# EAGLE design NanoRS485-MySens-v015 (EAGLE 7.6.0)
MAPLE-CUx Large Version
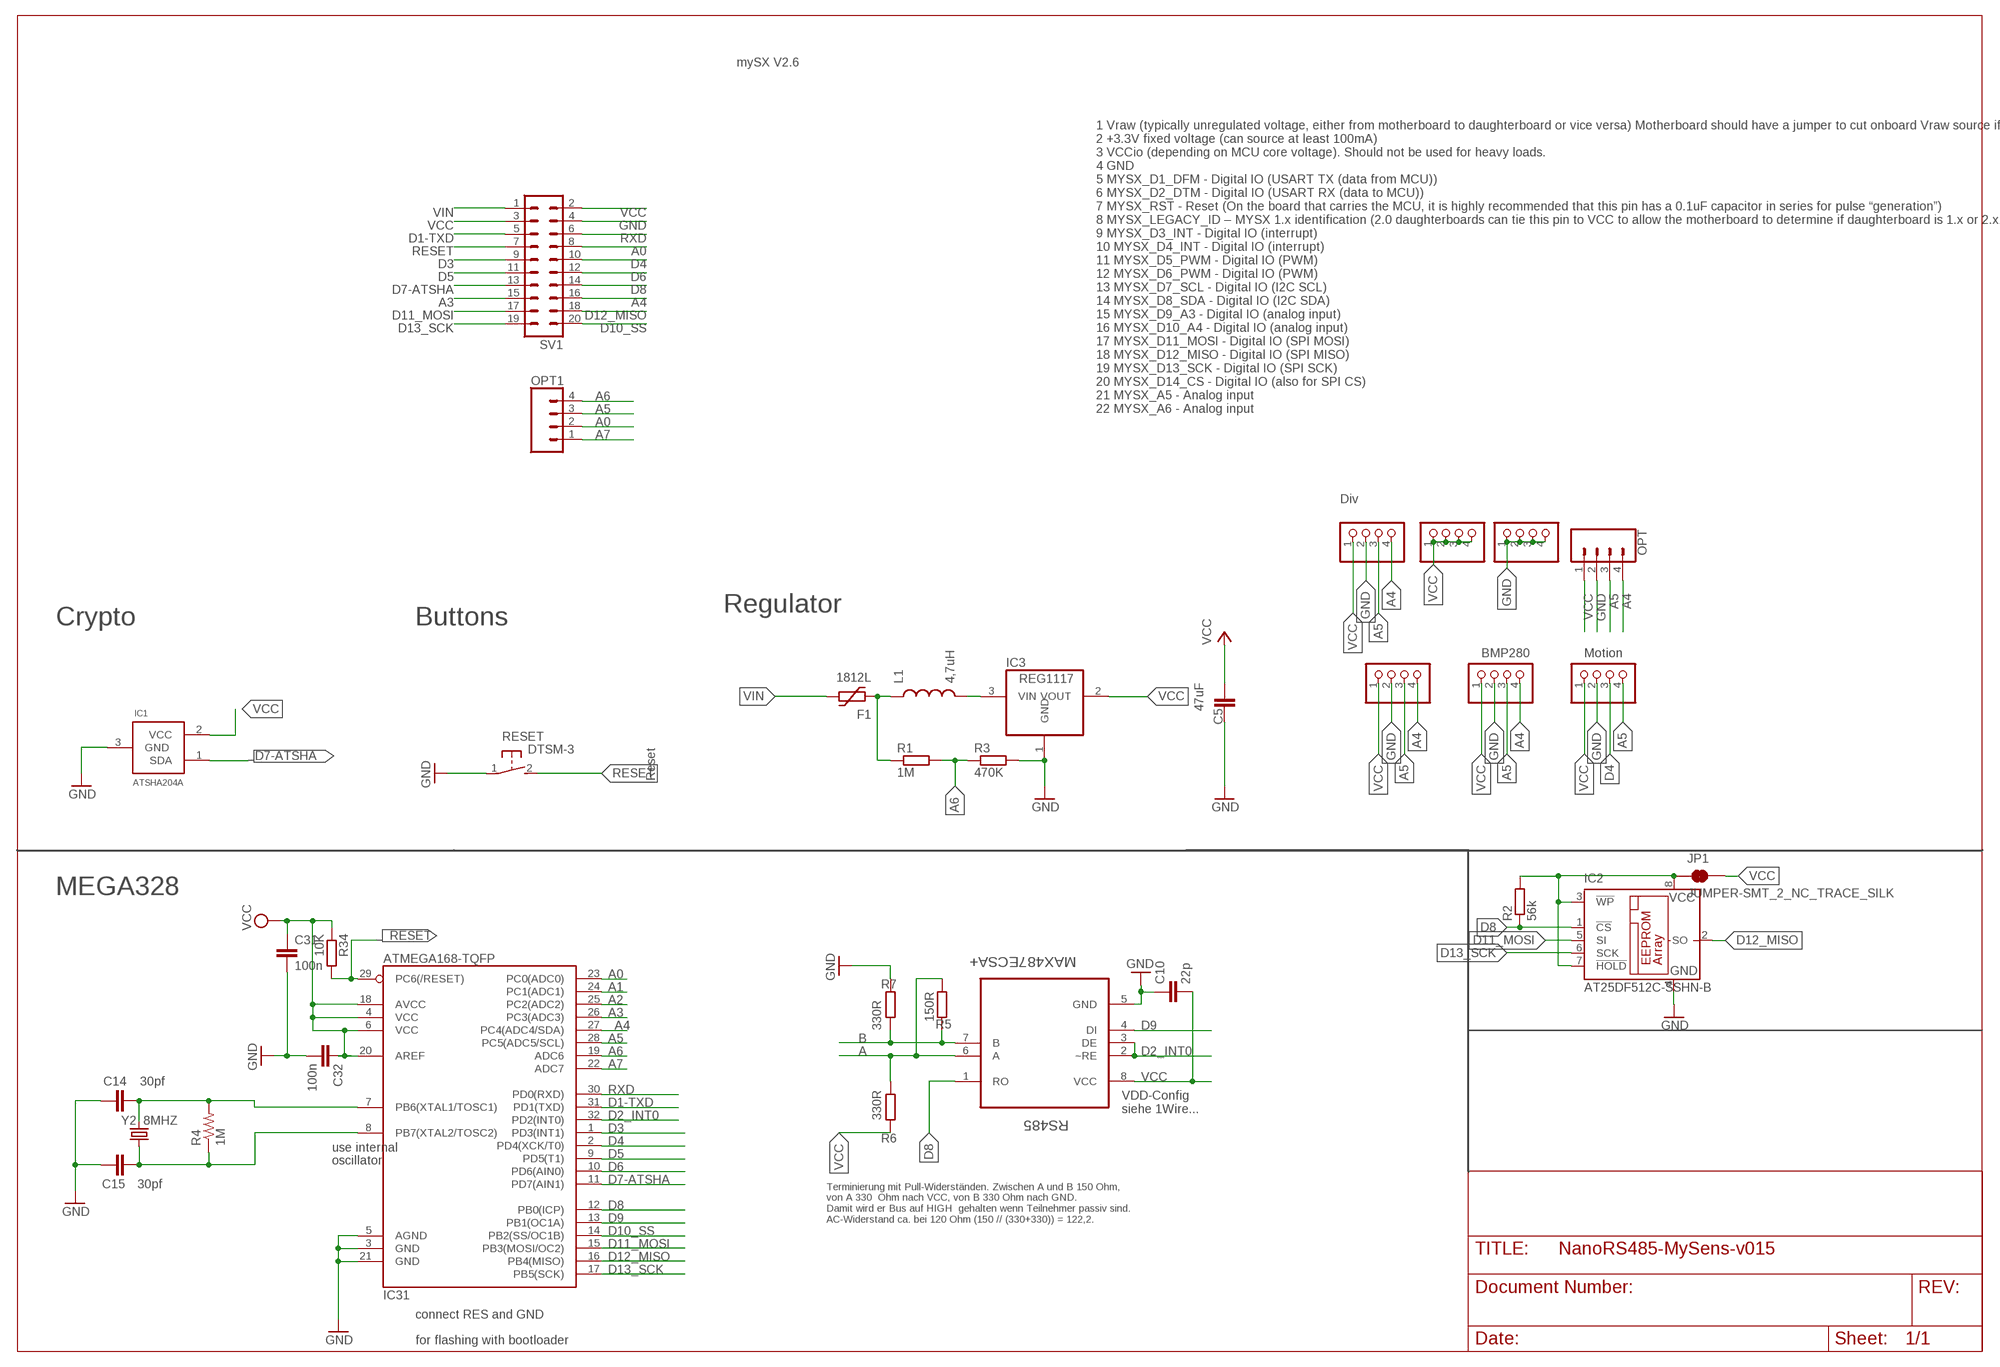
[diagram p0: schematic, sheet 1, part 1 of 2]
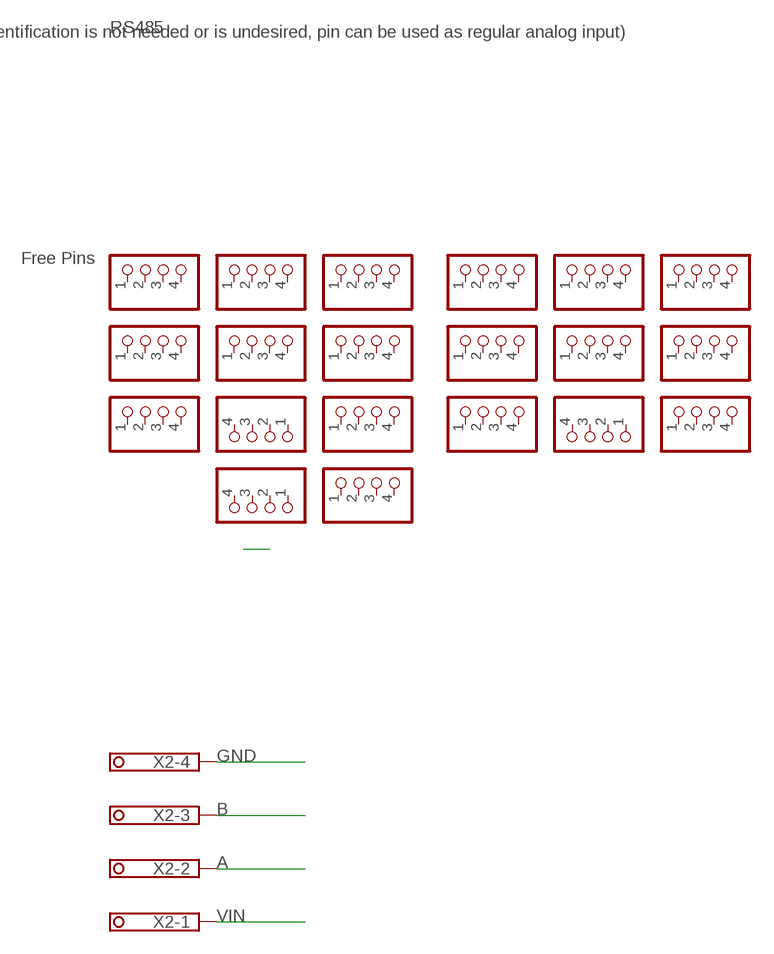
[diagram p1: schematic, sheet 1, part 2 of 2]

## Parts
BH1750  PINHD-1X04_2.54-S  [1X04-S]
C5  47uF  C-EUC1210  [C1210]
C10  22p  C-EUC0805  [C0805]
C14  30pf  CAP0805  [0805]
C15  30pf  CAP0805  [0805]
C31  100n  C-EUC0805  [C0805]
C32  100n  C-EUC0805  [C0805]
F1  1812L  [1812L]
I2C-1  PINHD-1X04_2.54-S  [1X04-S]
I2C-2  PINHD-1X04_2.54-S  [1X04-S]
IC1  ATSHA204A  [SOT23]
IC2  AT25DF512C-SSHN-B  25AA080SN  [SO-08]
IC3  REG1117  [SOT223]
IC31  ATMEGA168-TQFP  [TQFP32-08]
JP1  JUMPER-SMT_2_NC_TRACE_SILK  [SMT-JUMPER_2_NC_TRACE_SILK]
JP2  PINHD-1X04_2.54-S  [1X04-S]
JP3  PINHD-1X04_2.54-S  [1X04-S]
JP4  PINHD-1X04_2.54-S  [1X04-S]
JP5  PINHD-1X04_2.54-S  [1X04-S]
JP6  PINHD-1X04_2.54-S  [1X04-S]
JP7  PINHD-1X04_2.54-S  [1X04-S]
JP8  PINHD-1X04_2.54-S  [1X04-S]
JP9  PINHD-1X04_2.54-S  [1X04-S]
JP10  PINHD-1X04_2.54-S  [1X04-S]
JP11  PINHD-1X04_2.54-S  [1X04-S]
JP12  PINHD-1X04_2.54-S  [1X04-S]
JP13  PINHD-1X04_2.54-S  [1X04-S]
JP14  PINHD-1X04_2.54-S  [1X04-S]
JP15  PINHD-1X04_2.54-S  [1X04-S]
JP16  PINHD-1X04_2.54-S  [1X04-S]
JP17  PINHD-1X04_2.54-S  [1X04-S]
JP18  PINHD-1X04_2.54-S  [1X04-S]
JP19  PINHD-1X04_2.54-S  [1X04-S]
JP20  PINHD-1X04_2.54-S  [1X04-S]
JP21  PINHD-1X04_2.54-S  [1X04-S]
JP22  PINHD-1X04_2.54-S  [1X04-S]
JP23  PINHD-1X04_2.54-S  [1X04-S]
L1  4,7uH  INDUCTOR0805  [0805]
MOTION  PINHD-1X04_2.54-S  [1X04-S]
OPT  CONN_04  [1X04]
OPT1  CONN_04  [1X04]
R1  1M  R-EU_R0805  [R0805]
R2  56k  R-EU_M0805  [M0805]
R3  470K  R-EU_R0805  [R0805]
R4  1M  RESISTOR0805-RES  [0805]
R5  150R  R-EU_R0805  [R0805]
R6  330R  R-EU_R0805  [R0805]
R7  330R  R-EU_R0805  [R0805]
R34  10K  R-EU_R0805  [R0805]
RESET  DTSM-3  [DTSM-3]
RS485  MAX487ECSA+  [SOIC127P600X175-8N]
SV1  MA10-2  [MA10-2]
X2  1751264  [1751264]
Y2  8MHZ  CRYSTALTXC-7A  [CRYSTAL-TXC-7A]

## Nets
A: R5.1 R6.2 RS485.6(A) X2.2
A0: IC31.23(PC0(ADC0)) OPT1.2 SV1.8
A1: IC31.24(PC1(ADC1))
A2: IC31.25(PC2(ADC2))
A3: IC31.26(PC3(ADC3)) SV1.15
A4: BH1750.4 I2C-1.4 I2C-2.4 IC31.27(PC4(ADC4/SDA)) OPT.4 SV1.16
A5: BH1750.3 I2C-1.3 I2C-2.3 IC31.28(PC5(ADC5/SCL)) MOTION.4 OPT1.3 OPT.3
A6: IC31.19(ADC6) OPT1.4 R1.2 R3.1
A7: IC31.22(ADC7) OPT1.1
B: R5.2 R7.1 RS485.7(B) X2.3
D1-TXD: IC31.31(PD1(TXD)) SV1.5
D2_INT0: IC31.32(PD2(INT0)) RS485.2(~RE) RS485.3(DE)
D3: IC31.1(PD3(INT1)) SV1.9
D4: IC31.2(PD4(XCK/T0)) MOTION.3 SV1.10
D5: IC31.9(PD5(T1)) SV1.11
D6: IC31.10(PD6(AIN0)) SV1.12
D7-ATSHA: IC1.1(SDA) IC31.11(PD7(AIN1)) SV1.13
D8: IC2.1(!CS) IC31.12(PB0(ICP)) R2.1 RS485.1(RO) SV1.14
D9: IC31.13(PB1(OC1A)) RS485.4(DI)
D10_SS: IC31.14(PB2(SS/OC1B)) SV1.20
D11_MOSI: IC2.5(SI) IC31.15(PB3(MOSI/OC2)) SV1.17
D12_MISO: IC2.2(SO) IC31.16(PB4(MISO)) SV1.18
D13_SCK: IC2.6(SCK) IC31.17(PB5(SCK)) SV1.19
GND [PWR]: BH1750.2 C5.1 C10.1 C14.1 C15.1 C31.2 C32.2 I2C-1.2 I2C-2.2 IC1.3(GND) IC2.4(GND) IC3.1(GND) IC31.3(GND) IC31.5(AGND) IC31.21(GND) JP2.1 JP2.2 JP2.3 JP2.4 MOTION.2 OPT.2 R3.2 R7.2 RESET.1 RS485.5(GND) SV1.4 X2.4
N$3: C14.2 IC31.7(PB6(XTAL1/TOSC1)) R4.2 Y2.P$2
N$19: C15.2 IC31.8(PB7(XTAL2/TOSC2)) R4.1 Y2.P$1
RAW: IC3.3(VIN) L1.2
RESET: IC31.29(PC6(/RESET)) R34.2 RESET.2 SV1.7
RXD: IC31.30(PD0(RXD)) SV1.6
VCC [PWR]: BH1750.1 C5.2 C10.2 C31.1 C32.1 I2C-1.1 I2C-2.1 IC1.2(VCC) IC3.2(VOUT) IC31.4(VCC) IC31.6(VCC) IC31.18(AVCC) IC31.20(AREF) JP1.2 JP3.1 JP3.2 JP3.3 JP3.4 MOTION.1 OPT.1 R6.1 R34.1 RS485.8(VCC) SV1.2 SV1.3
VCC1 [PWR]: IC2.3(!WP) IC2.7(!HOLD) IC2.8(VCC) JP1.1 R2.2
VIN [PWR]: F1.P$2 SV1.1 X2.1
VIN-FUSED [PWR]: F1.P$1 L1.1 R1.1
Unconnected: JP4.1 JP4.2 JP4.3 JP4.4 JP5.1 JP5.2 JP5.3 JP5.4 JP6.1 JP6.2 JP6.3 JP6.4 JP7.1 JP7.2 JP7.3 JP7.4 JP8.1 JP8.2 JP8.3 JP8.4 JP9.1 JP9.2 JP9.3 JP9.4 JP10.1 JP10.2 JP10.3 JP10.4 JP11.1 JP11.2 JP11.3 JP11.4 JP12.1 JP12.2 JP12.3 JP12.4 JP13.1 JP13.2 JP13.3 JP13.4 JP14.1 JP14.2 JP14.3 JP14.4 JP15.1 JP15.2 JP15.3 JP15.4 JP16.1 JP16.2 JP16.3 JP16.4 JP17.1 JP17.2 JP17.3 JP17.4 JP18.1 JP18.2 JP18.3 JP18.4 JP19.1 JP19.2 JP19.3 JP19.4 JP20.1 JP20.2 JP20.3 JP20.4 JP21.1 JP21.2 JP21.3 JP21.4 JP22.1 JP22.2 JP22.3 JP22.4 JP23.1 JP23.2 JP23.3 JP23.4

## Notes on the sheet
- mySX V2.6
- RS485
- Free Pins
- 1 Vraw (typically unregulated voltage, either from motherboard to daughterboard or vice versa) Motherboard should have a jumper to cut onboard Vraw source if daughterboard provides Vraw. Be sure to check motherboard constraints on Vraw before connecting a daughterboard that provides Vraw (for over voltage protection). Should be able to source at least 100mA and all boards are recommended to support a voltage up to 24V on this pin.
  2 +3.3V fixed voltage (can source at least 100mA)
  3 VCCio (depending on MCU core voltage). Should not be used for heavy loads.
  4 GND
  5 MYSX_D1_DFM - Digital IO (USART TX (data from MCU))
  6 MYSX_D2_DTM - Digital IO (USART RX (data to MCU))
  7 MYSX_RST - Reset (On the board that carries the MCU, it is highly recommended that this pin has a 0.1uF capacitor in series for pulse “generation”)
  8 MYSX_LEGACY_ID – MYSX 1.x identification (2.0 daughterboards can tie this pin to VCC to allow the motherboard to determine if daughterboard is 1.x or 2.x. If identification is not needed or is undesired, pin can be used as regular analog input)
  9 MYSX_D3_INT - Digital IO (interrupt)
  10 MYSX_D4_INT - Digital IO (interrupt)
  11 MYSX_D5_PWM - Digital IO (PWM)
  12 MYSX_D6_PWM - Digital IO (PWM)
  13 MYSX_D7_SCL - Digital IO (I2C SCL)
  14 MYSX_D8_SDA - Digital IO (I2C SDA)
  15 MYSX_D9_A3 - Digital IO (analog input)
  16 MYSX_D10_A4 - Digital IO (analog input)
  17 MYSX_D11_MOSI - Digital IO (SPI MOSI)
  18 MYSX_D12_MISO - Digital IO (SPI MISO)
  19 MYSX_D13_SCK - Digital IO (SPI SCK)
  20 MYSX_D14_CS - Digital IO (also for SPI CS)
  21 MYSX_A5 - Analog input
  22 MYSX_A6 - Analog input
- Div
- Regulator
- Crypto | Buttons
- BMP280 | Motion
- Reset
- MEGA328
- VDD-Config
  siehe 1Wire...
- use internal
- oscillator
- Terminierung mit Pull-Widerständen. Zwischen A und B 150 Ohm,
  von A 330  Ohm nach VCC, von B 330 Ohm nach GND. 
  Damit wird er Bus auf HIGH  gehalten wenn Teilnehmer passiv sind.
  AC-Widerstand ca. bei 120 Ohm (150 // (330+330)) = 122,2.
- connect RES and GND
- for flashing with bootloader

## Library data of the parts
BH1750 I2C-1 I2C-2 JP2-JP23 MOTION = pinhead-2:PINHD-1X04: PIN HEADER
C5 C10 C31 C32 = rcl:C-EU: CAPACITOR, European symbol
C14 C15 = doug:CAP: Capacitor Standard 0603 ceramic capacitor, and 0.1" leaded capacitor.
F1 = ptc-littlefuse:1812L
IC1 = Sensor:ATSHA204A
IC2 = microchip:25*: Serial EEPROM 4K/ 8K , SPI bus; MF: MICROCHIP; MPN: 25AA080/SN; OC_FARNELL: 1816072; OC_NEWARK: 92C7351
IC3 = burr-brown:REG1117: 800mA and 1A Low Dropout (LDO) Positive Regulator 1.8V, 2.5V, 2.85V, 3.3V, 5V, and Adj; MPN: REG1117; OC_FARNELL: 1097566; OC_NEWARK: 14P6981
IC31 = atmel:ATMEGA168: Atmel Atmega 168/328/328P
JP1 = SparkFun-Jumpers:JUMPER-SMT_2_NC_TRACE: Normally closed trace jumper This jumper has a trace between two pads so it's normally closed (NC). Use a razor knife to open the connection. For best results follow the IPC guidelines for cutting traces: Cutout at least 0.063 mm (0.005 in). Remove all loose material to clean up the cut area. Seal the cut with an approved epoxy. Reapply solder to reclose the connection.
L1 = SparkFun-Passives:INDUCTOR: Inductors Basic Inductor/Choke - 0603 and 1206. Footprints are not proven and vary greatly between part numbers.
OPT OPT1 = SparkFun-Connectors:CONN_04: Multi connection point. Often used as Generic Header-pin footprint for 0.1 inch spaced/style header connections On any of the 0.1 inch spaced packages, you can populate with these: Break Away Headers - Straight <https://www.sparkfun.com/products/116> (PRT-00116) Break Away Male Headers - Right Angle <https://www.sparkfun.com/products/553> (PRT-00553) Female Headers <https://www.sparkfun.com/products/115> (PRT-00115) Break Away Headers - Machine Pin <https://www.sparkfun.com/products/117> (PRT-00117) Break Away Female Headers - Swiss Machine Pin <https://www.sparkfun.com/products/743> (PRT-00743) For SCREWTERMINALS and SPRING TERMINALS visit here: Screw Terimnals on SparkFun.com <https://www.sparkfun.com/search/results?term=Screw+Terminals> (5mm/3.5mm/2.54mm spacing) This device is also useful as a general connection point to wire up your design to another part of your project. Our various solder wires solder well into these plated through hole pads. Hook-Up Wire - Assortment (Stranded, 22 AWG) <https://www.sparkfun.com/products/11375> (PRT-11375) Hook-Up Wire - Assortment (Solid Core, 22 AWG) <https://www.sparkfun.com/products/11367> (PRT-11367) View the entire wire category on our website here <https://www.sparkfun.com/categories/141> Special notes: Molex polarized connector foot print use with SKU : PRT-08231 with associated crimp pins and housings. 1MM SMD Version SKU: PRT-10208; PROD_ID: CONN-09696
R1 R3 R5-R7 R34 = rcl:R-EU_: RESISTOR, European symbol
R2 = resistor:R-EU_: RESISTOR, European symbol
R4 = doug:RESISTOR: Resistor Basic schematic elements and footprints for 0603, 1206, and PTH resistors.
RESET = mechanics:DTSM-3: Diptronics SMD button 6x3.5 mm
RS485 = Maxim_By_element14_Batch_1:MAX487ECSA+: Low-Power, Slew-Rate-Limited RS-485/RS-422 Transceivers; MPN: MAX487ECSA+; OC_FARNELL: 9724532; OC_NEWARK: 68K4803; PACKAGE: SOIC-8; SUPPLIER: Maxim
SV1 = con-lstb:MA10-2: PIN HEADER; OC_FARNELL: unknown; OC_NEWARK: unknown
X2 = con-phoenix-350:1751264: MKDS 1/ 4-3,5 Printklemme Nennstrom: 10 A Bemessungsspannung: 160 V Raster: 3,5 mm Polzahl: 4 Montageart: Löten Anschlussart: Schraubanschluss Anschlussrichtung vom Leiter zur Platine: 0° Source: http://eshop.phoenixcontact.com .. 1751264.pdf; MPN: 1751264; OC_FARNELL: unknown; OC_NEWARK: 10R0934
Y2 = SparkFun-FreqCtrl:CRYSTAL: Various standard crystals. Proven footprints.

## Net classes
0 default: width 0.254 mm
1 PWR: width 0.406 mm

## Board
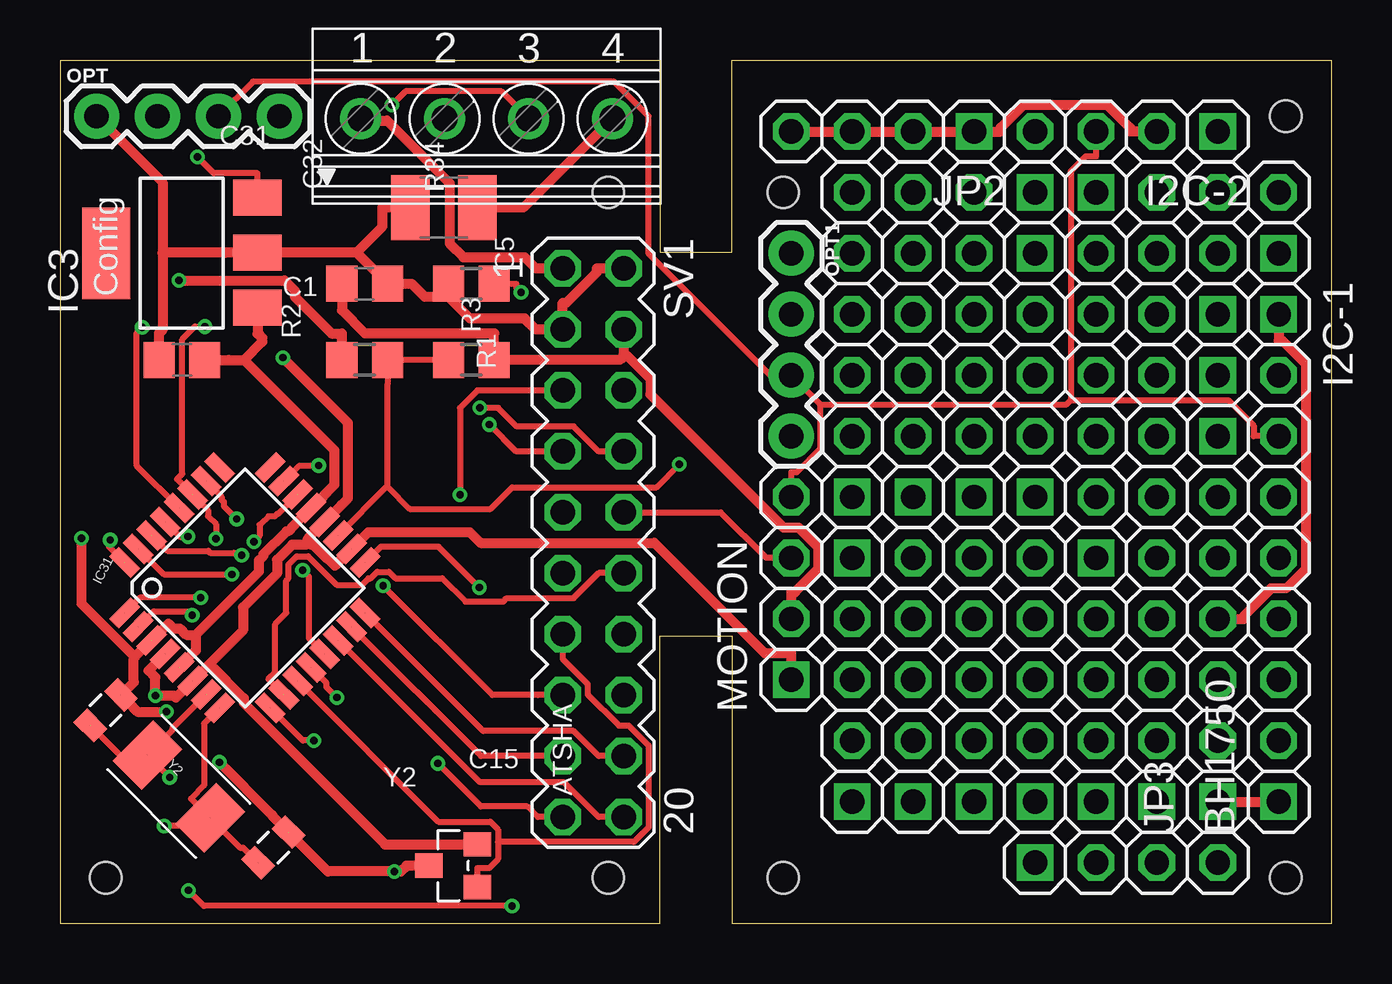
[diagram p2: board, top side]
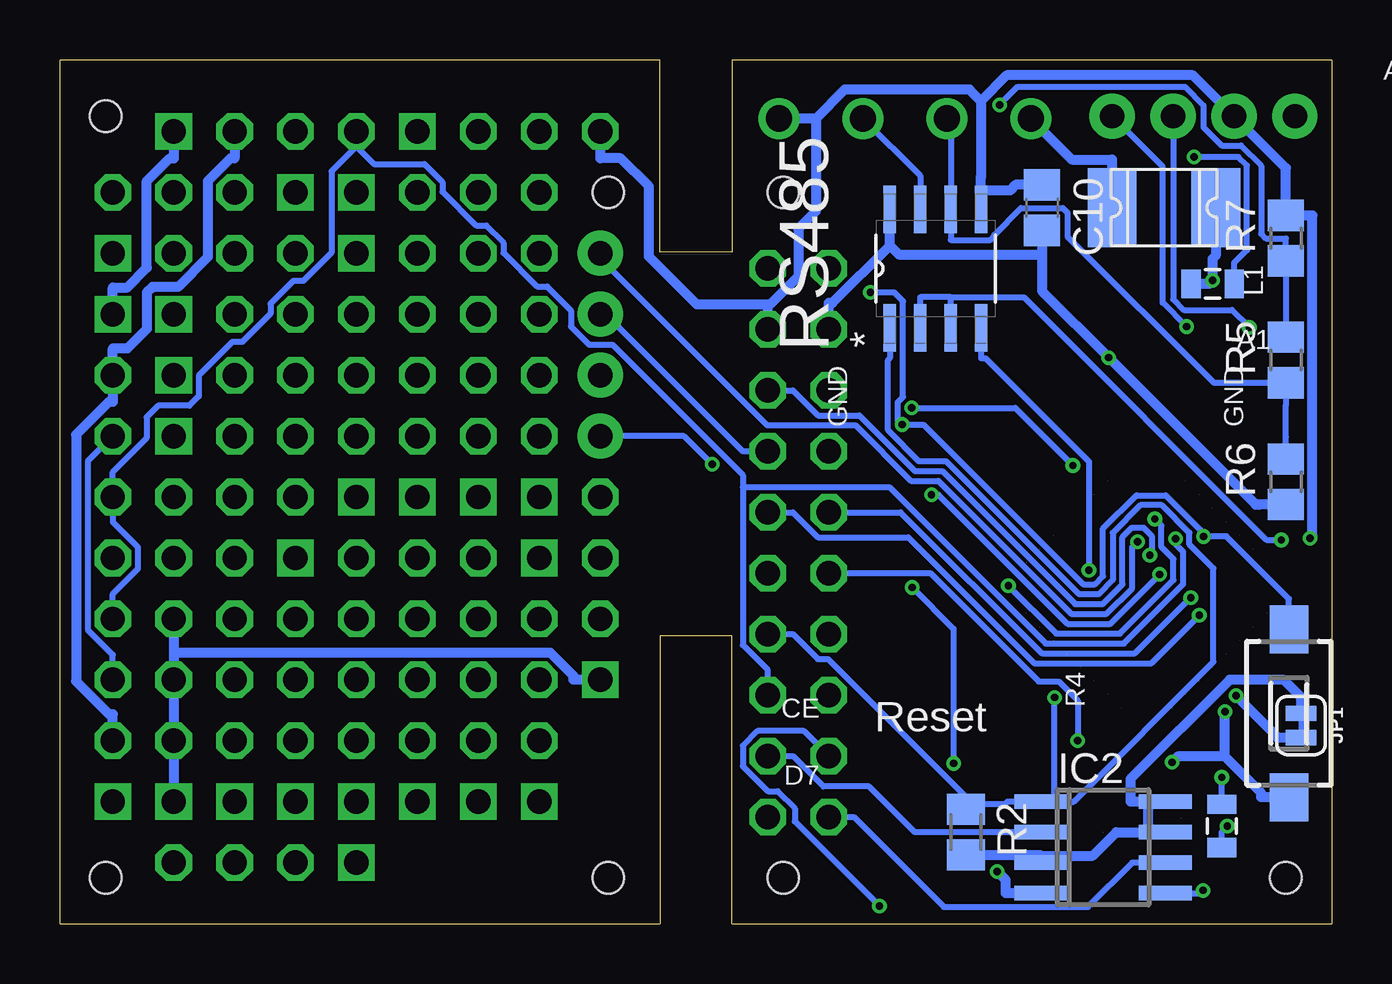
[diagram p3: board, bottom side, seen from below]

Size 53 x 36 mm. Coordinates in mm from the lower left corner, seen from the top.
Outline: 25,0 0,0 0,36 25,36 25,28 28,28 28,36 53,36 53,0 28,0 28,12 25,12 25,0
Copper layers (1*16): Top 0.035mm / dielectric 1.5mm / Bottom 0.035mm
Design rules "SeeedStudio_2layer_DRU_no_angle_20140221": minimum track width 6mil, minimum drill 12mil, track to track 6mil, track to pad 6mil, pad to pad 6mil, via to via 6mil, smd to smd 0mil, copper to edge 10mil, drill to drill 10mil, minimum pad ring 10mil, minimum via ring 6mil, stop-mask expansion 2mil, vias tented up to drill 100mil, thermal gap 10mil
Holes 1.3 mm at 22.86,30.48 22.86,1.91 1.91,1.91 30.14,30.48 51.09,1.91 30.14,1.91 51.09,33.66

### Footprints (pad centres in the part's own frame; a part is rotated, then mirrored left to right if it is on the bottom)
1X04-S = drill 1.016 square: 1 -3.81,0 | drill 1.016 octagon: 2 -1.27,0; 3 1.27,0; 4 3.81,0
C1210 = smd 1.6 x 2.7: 1 -1.4,0; 2 1.4,0
C0805 = smd 1.3 x 1.5: 1 -0.95,0; 2 0.95,0
0805 = smd 0.8 x 1.2: 1 -0.9,0; 2 0.9,0
1812L = smd 2.03 x 3.3: P$1 -2.16,0; P$2 2.16,0
SOT23 = smd 1.016 x 1.143: 1 -0.889,-1.016; 2 0.889,-1.016; 3 0,1.016
SO-08 = smd 0.6 x 2.2: 1 -1.905,-2.6; 2 -0.635,-2.6; 3 0.635,-2.6; 4 1.905,-2.6; 5 1.905,2.6; 6 0.635,2.6; 7 -0.635,2.6; 8 -1.905,2.6
SOT223 = smd 1.499 x 2.007: 1 -2.261,-3.15; 2 0.025,-3.15; 3 2.311,-3.15 | smd 3.81 x 2.007: 4 0,3.15
TQFP32-08 = smd 1.27 x 0.559: 1 -4.293,2.8; 2 -4.293,2; 3 -4.293,1.2; 4 -4.293,0.4; 5 -4.293,-0.4; 6 -4.293,-1.2; 7 -4.293,-2; 8 -4.293,-2.8; 17 4.293,-2.8; 18 4.293,-2; 19 4.293,-1.2; 20 4.293,-0.4; 21 4.293,0.4; 22 4.293,1.2; 23 4.293,2; 24 4.293,2.8 | smd 0.559 x 1.27: 9 -2.8,-4.293; 10 -2,-4.293; 11 -1.2,-4.293; 12 -0.4,-4.293; 13 0.4,-4.293; 14 1.2,-4.293; 15 2,-4.293; 16 2.8,-4.293; 25 2.8,4.293; 26 2,4.293; 27 1.2,4.293; 28 0.4,4.293; 29 -0.4,4.293; 30 -1.2,4.293; 31 -2,4.293; 32 -2.8,4.293
SMT-JUMPER_2_NC_TRACE_SILK = smd 0.635 x 1.27: 1 -0.508,0; 2 0.508,0
1X04 = drill 1.016 pad 1.88: 1 0,0; 2 2.54,0; 3 5.08,0; 4 7.62,0
R0805 = smd 1.3 x 1.5: 1 -0.95,0; 2 0.95,0
M0805 = smd 1.3 x 1.6: 1 -0.95,0; 2 0.95,0
DTSM-3 = smd 2 x 1.6: 1 -3.494,0; 2 3.494,0
SOIC127P600X175-8N = smd 1.981 x 0.533: 1 -2.464,1.905; 2 -2.464,0.635; 3 -2.464,-0.635; 4 -2.464,-1.905; 5 2.464,-1.905; 6 2.464,-0.635; 7 2.464,0.635; 8 2.464,1.905
MA10-2 = drill 1.016 octagon: 1 -11.43,-1.27; 2 -11.43,1.27; 3 -8.89,-1.27; 4 -8.89,1.27; 5 -6.35,-1.27; 6 -6.35,1.27; 7 -3.81,-1.27; 8 -3.81,1.27; 9 -1.27,-1.27; 10 -1.27,1.27; 11 1.27,-1.27; 12 1.27,1.27; 13 3.81,-1.27; 14 3.81,1.27; 15 6.35,-1.27; 16 6.35,1.27; 17 8.89,-1.27; 18 8.89,1.27; 19 11.43,-1.27; 20 11.43,1.27
1751264 = drill 1.1 pad 1.7: 1 -5.25,-0.1; 2 -1.75,-0.1; 3 1.75,-0.1; 4 5.25,-0.1
CRYSTAL-TXC-7A = smd 1.7 x 2.4: P$1 1.85,0; P$2 -1.85,0

### Placement (x,y rotation side)
BH1750  50.8,8.89 90 top
C5  16,29.84 180 top
C10  12.06,29.84 270 bottom
C14  1.91,8.89 225 top
C15  8.89,3.17 225 top
C31  12.7,26.67 180 top
C32  5.08,23.5 0 top
F1  6.99,29.84 180 bottom
I2C-1  50.8,21.59 270 top
I2C-2  44.45,33.02 180 top
IC1  16.38,2.41 90 top
IC2  9.53,3.17 270 bottom
IC3  5.08,27.94 90 top
IC31  7.71,14 45 top
JP1  1.27,8.26 270 bottom
JP2  34.29,33.02 180 top
JP3  48.26,8.89 90 top
JP4  33.02,21.59 90 top
JP5  46.99,30.48 0 top
JP6  35.56,21.59 90 top
JP7  44.45,2.54 0 top
JP8  38.1,21.59 90 top
JP9  36.83,27.94 180 top
JP10  36.83,15.24 0 top
JP11  44.45,22.86 180 top
JP12  36.83,30.48 180 top
JP13  44.45,17.78 0 top
JP14  44.45,20.32 180 top
JP15  44.45,25.4 180 top
JP16  46.99,27.94 180 top
JP17  45.72,8.89 90 top
JP18  46.99,15.24 0 top
JP19  40.64,8.89 90 top
JP20  43.18,8.89 90 top
JP21  35.56,8.89 90 top
JP22  38.1,8.89 90 top
JP23  33.02,8.89 90 top
L1  4.95,26.67 0 bottom
MOTION  30.48,13.97 90 top
OPT  1.52,33.66 0 top
OPT1  30.48,27.94 270 top
R1  12.7,23.5 0 top
R2  15.24,3.81 270 bottom
R3  17.14,23.5 0 top
R4  4.57,4.06 90 bottom
R5  1.91,23.5 90 bottom
R6  1.91,18.41 90 bottom
R7  1.91,28.57 90 bottom
R34  17.14,26.67 0 top
RESET  1.78,8.76 90 bottom
RS485  16.51,27.3 90 bottom
SV1  22.23,15.88 270 top
X2  17.78,33.66 0 top
Y2  4.95,5.71 315 top

### Tracks (layer width: path | path; a pad name or v marks a point on that pad's centre or on a via)
A
  Bottom 0.254: X2.2 15.88,33.4 RS485.6 15.88,28.5 14.22,28.5 14.06,28.66 14.06,28.7 12.94,29.82 11.2,29.82 11,29.63 11,28.64 4.91,22.55 R5.1 1.91,21.62 1.91,20.29 R6.2
A0  (via drill 0.3 pad 0.61)  (1 unrouted)
  Top 0.254: v17.5,21.5 18.27,21.5 19.04,20.73 21.41,20.73 22.45,19.68 SV1.8 | v10.78,19.09 9.98,19.09 IC31.23
  Bottom 0.254: v17.5,21.5 13.19,21.5 v10.78,19.09 | SV1.8 24.54,19.68 30.25,25.4 OPT1.2
A3  (via drill 0.3 pad 0.61)  (1 unrouted)
  Top 0.254: 6.74,17.8 | 6.74,17.8 6.74,17.67 6.83,17.58 6.83,17.4 v7.37,16.86 | v13.47,14.08 18.02,9.53 19.91,9.53 SV1.15 | IC31.26 6.74,17.8
  Bottom 0.254: v13.47,14.08 11.47,12.09 8.81,12.09 6.59,14.31 6.59,15.19 7.09,15.69 7.09,16.58 v7.37,16.86
A4  (via drill 0.3 pad 0.61)  (1 unrouted)
  Top 0.254: 6.17,17.23 | 6.17,17.23 6.17,16.98 6.5,16.65 v6.5,16.04 | v6.04,24.89 5.62,24.89 5.1,24.36 5.1,18.75 4.88,18.53 IC31.27 5.85,17.56 6.17,17.23
  Bottom 0.254: 24.54,18.19 18.43,18.19 11.91,11.67 8.65,11.67 6.18,14.15 6.18,15.49 6.5,15.81 v6.5,16.04 | v6.04,24.89 7.04,25.88 7.04,31.55 OPT.4 | BH1750.4 50.8,13.74 49.76,14.78 49.76,15.7 50.8,16.74 I2C-1.4 50.8,18.3 50.8,18.82 49.39,20.23 49.39,21.11 48.91,21.59 47.61,21.59 47.22,21.98 47.22,22.84 45.82,24.25 45.4,24.25 44.22,25.43 44.22,25.84 43.28,26.79 42.86,26.79 41.68,27.97 41.68,31.36 40.65,32.4 40.64,32.4 | 40.64,32.4 39.91,31.66 37.81,31.66 37.06,30.91 37.06,30.5 35.65,29.1 35.24,29.1 34.52,28.38 34.52,27.96 33.11,26.55 32.7,26.55 31.7,25.56 31.7,24.89 30.94,24.13 29.97,24.13 24.54,18.7 24.54,18.19 | 40.64,32.4 40.64,32.5 I2C-2.4 | 24.54,18.19 24.54,11.61 23.5,10.57 SV1.16
A5  (via drill 0.3 pad 0.61)  (1 unrouted)
  Top 0.254: 31.7,21.64 OPT1.3 29.6,22.86 24.53,27.92 24.53,33.65 23.09,35.09 8.04,35.09 OPT.3 | 31.7,21.64 31.7,19.82 30.71,18.82 30.48,18.82 MOTION.4 | 31.7,21.64 41.95,21.64 42.13,21.82 | 42.13,21.82 48.69,21.82 49.76,20.75 49.76,20.32 I2C-1.3 | 42.13,21.82 42.13,31.36 42.75,31.98 43.18,31.98 I2C-2.3 | IC31.28 3.2,19.07 3.2,24.63 v3.43,24.86
  Bottom 0.254: BH1750.3 50.8,11.2 51.84,12.24 51.84,19.28 I2C-1.3 | OPT.3 6.6,26.02 6.16,25.58 4.15,25.58 v3.43,24.86
A6  (via drill 0.3 pad 0.61)  (1 unrouted)
  Top 0.254: 13.65,18.21 14.57,17.29 17.95,17.29 18.85,18.19 24.86,18.19 v25.81,19.14 | 13.65,18.21 13.65,22.47 R1.2 R3.1 | IC31.19 13.62,18.21 13.65,18.21
  Bottom 0.254: v25.81,19.14 26.99,20.32 OPT1.4
A7  (via drill 0.3 pad 0.61)  (1 unrouted)
  Top 0.254: v8.08,15.92 8.32,16.16 8.32,16.62 8.35,16.65 8.37,16.65 8.7,16.97 8.96,16.97 9.07,17.09 9.11,17.09 9.25,17.23 IC31.22
  Bottom 0.254: OPT1.1 30.48,27.73 23.52,20.78 19.85,20.78 17.53,18.46 16.39,18.46 10.85,12.91 9.38,12.91 8.31,13.98 8.31,15.69 v8.08,15.92
B  (via drill 0.3 pad 0.61)
  Top 0.254: X2.3 18.4,34.69 14.4,34.69 v13.84,34.13
  Bottom 0.254: v13.84,34.13 13.09,34.88 6.1,34.88 5.33,34.11 5.33,33.2 4.57,32.44 3.78,32.44 2.93,31.59 2.93,28.76 2.73,28.55 1.91,28.55 R7.1 R5.2 | X2.3 17.14,31.17 RS485.7
D1-TXD  (via drill 0.3 pad 0.61)  (1 unrouted)
  Top 0.254: SV1.5 17.4,22.23 16.67,21.5 v16.67,17.87 | IC31.31 4.33,14.55 v7.17,14.55
  Bottom 0.254: v16.67,17.87 16.39,17.87 11.01,12.5 9.21,12.5 7.17,14.54 v7.17,14.55
D2_INT0  (via drill 0.3 pad 0.61)  (1 unrouted)
  Top 0.254: v2.09,15.99 2.05,15.95 2.05,15.7 IC31.32
  Bottom 0.254: 15.88,26.11 12.83,26.11 2.71,15.99 v2.09,15.99 | 15.88,26.11 17.14,26.11 RS485.2 | RS485.3 15.88,26.11
D3  (via drill 0.3 pad 0.61)  (1 unrouted)
  Top 0.254: v5.86,13.59 3.34,13.59 IC31.1
  Bottom 0.254: SV1.9 17.97,17.14 12.08,11.26 8.19,11.26 v5.86,13.59
D4  (via drill 0.3 pad 0.61)  (1 unrouted)
  Top 0.254: IC31.2 3.91,13.02 3.94,12.99 5.36,12.99 v5.51,12.85 | MOTION.3 29.44,15.24 27.53,17.14 SV1.10
  Bottom 0.254: v5.51,12.85 7.51,10.85 12.39,10.85 17.64,16.1 21.41,16.1 22.45,17.14 SV1.10
D5  (via drill 0.3 pad 0.61)  (1 unrouted)
  Top 0.254: v10.58,7.62 10.12,7.62 IC31.9
  Bottom 0.254: v10.58,7.62 10.58,9.3 11.37,10.08 12.2,10.08 16.72,14.61 19.91,14.61 SV1.11
D6  (1 unrouted)
  Top 0.254: 12.99,14.43 12.95,14.39 12.86,14.39 12.59,14.12 11.54,14.12 10.35,15.31 9.87,15.31 9.53,14.97 9.53,14.39 9.44,14.3 9.44,12.95 8.97,12.49 8.97,10.48 8.69,10.19 IC31.10 | 12.99,14.43 | 12.99,14.43 13.23,14.67 13.71,14.67 13.98,14.39 15.93,14.39 16.9,13.42 18.48,13.42 18.62,13.56 21.41,13.56 22.45,14.61 SV1.12
D7-ATSHA  (1 unrouted)
  Top 0.254: 18.26,3.4 18.26,2.68 17.89,2.31 17.4,2.31 IC1.1 | IC31.11 15.77,4.24 17.94,4.24 18.26,3.92 18.26,3.4 | 18.26,3.4 23.93,3.4 24.54,4.01 24.54,7.42 23.7,8.26 23.29,8.26 22,9.55 22,9.98 20.95,11.02 SV1.13
D8  (via drill 0.3 pad 0.61)  (1 unrouted)
  Top 0.254: IC31.12 11.11,10.03 11.11,9.85 v11.54,9.42
  Bottom 0.254: 11.54,5.08 v11.54,9.42 | 11.54,5.08 10.75,5.08 4.92,10.91 4.92,14.81 5.92,15.81 5.92,16.28 7.08,17.45 7.96,17.45 9.12,16.29 9.12,14.31 9.71,13.73 10.52,13.73 16.06,19.27 17.19,19.27 18.49,20.56 18.49,23.5 18.41,23.57 RS485.1 | 11.54,5.08 IC2.1 13.5,5.08 13.59,4.99 15.24,4.99 | 15.24,4.99 15.24,5.22 15.24,5.28 20.98,11.02 21.41,11.02 22.45,12.06 SV1.14 | R2.1 15.24,4.99
D9  (via drill 0.3 pad 0.61)  (1 unrouted)
  Top 0.254: v10.11,14.72 10.38,14.45 10.38,11.89 IC31.13
  Bottom 0.254: v10.11,14.72 10.11,19.25 14.43,23.57 14.61,23.57 RS485.4
D10_SS  (1 unrouted)
  Top 0.254: IC31.14 17.51,5.89 21.01,5.89 22.45,4.45 SV1.20
D11_MOSI  (via drill 0.3 pad 0.61)  (1 unrouted)
  Top 0.254: v18.85,0.73 6,0.73 v5.35,1.38 | SV1.17 17.55,6.99 IC31.15
  Bottom 0.254: SV1.17 22,8.03 23.93,8.03 24.54,7.41 24.54,6.56 23.5,5.51 23.09,5.51 22.37,4.79 22.37,4.26 v18.85,0.73 | IC2.5 5.55,1.27 5.43,1.38 v5.35,1.38
D12_MISO  (1 unrouted)
  Top 0.254: SV1.18 22.45,6.99 21.41,8.03 17.64,8.03 IC31.16
  Bottom 0.254: SV1.18 22.45,6.99 21.18,5.71 19.27,5.71 17.37,3.81 IC2.2
D13_SCK  (via drill 0.3 pad 0.61)  (1 unrouted)
  Top 0.254: v15.75,6.67 17.55,4.88 19.48,4.88 19.91,4.45 SV1.19 | IC31.17 13.37,15.7 15.78,15.7 v17.47,14.01
  Bottom 0.254: v17.47,14.01 15.75,12.29 v15.75,6.67 | IC2.6 8.3,2.54 10.15,0.69 16.16,0.69 19.91,4.45 SV1.19
GND  (via drill 0.3 pad 0.61)  (4 unrouted)
  Top 0.406: IC31.5 5.66,11.38 | 3.12,11.11 IC31.3 4.53,12.51 4.74,12.3 5,12.3 5.26,12.04 5.66,12.04 | 3.12,11.11 3.08,11.06 3.08,10.06 C14.1 2.88,9.19 3.22,8.85 3.23,8.83 v4.44,8.83 | v0.89,16.06 0.89,13.34 3.12,11.11 | 23.5,23.65 23.34,23.5 R3.2 18.09,24.6 12.71,24.6 11.75,25.56 C31.2 | 7.67,23.5 8.44,24.25 8.44,24.41 8.28,24.57 8.23,24.57 IC3.1 | 7.67,23.5 7.04,23.5 C32.2 | 7.67,23.5 11.44,19.73 11.44,18.29 11.16,18.02 10.81,17.66 IC31.21 9.76,16.61 9.5,16.35 9.44,16.35 8.49,15.4 8.49,15.33 8.3,15.14 8.3,14.67 5.66,12.04 | v6.65,6.72 8.85,4.52 8.85,4.49 C15.1 11.16,2.17 v13.94,2.17 14.2,2.17 14.44,2.41 IC1.3 | 5.66,12.04 5.66,11.38 | 5.66,11.38 | X2.4 19.32,29.84 C5.1 | 23.5,23.65 23.5,23.79 SV1.4 | MOTION.2 30.48,13.82 30.64,13.82 31.6,14.78 31.6,15.7 30.79,16.51 30.16,16.51 24.61,22.06 24.61,22.7 23.66,23.65 23.5,23.65 | I2C-2.2 44.6,33.02 44.6,33.18 43.64,34.14 40.17,34.14 39.22,33.19 39.22,33.02 JP2.1 JP2.2 JP2.3 JP2.4
  Bottom 0.406: v0.89,16.06 0.8,16.15 0.8,29.52 R7.2 1.91,31.5 OPT.2 5.77,35.36 13.55,35.36 14.62,34.29 | C10.1 13.17,30.8 13.39,30.57 14.61,30.57 | 14.61,30.57 14.61,31.11 14.62,31.13 14.62,34.29 | RS485.5 14.61,30.57 | 14.62,34.29 15.09,34.76 20.29,34.76 21.5,33.55 | 4.45,6.96 v4.45,8.83 v4.44,8.83 | 4.45,6.96 6.41,6.96 v6.65,6.72 | 4.45,6.96 2.93,5.45 2.93,5.27 RESET.1 | SV1.4 23.5,25.8 | JP2.4 30.48,31.9 29.63,31.9 28.46,30.73 28.46,27.81 26.45,25.8 23.5,25.8 | 21.5,33.55 21.5,29.69 22.23,28.97 22.23,26.99 23.41,25.8 23.5,25.8 | 21.5,33.55 X2.4 | I2C-2.2 45.72,31.9 45.89,31.9 46.84,30.95 46.84,27.78 48.08,26.54 49.16,26.54 49.38,26.31 49.38,24.79 50.19,23.98 50.8,23.98 I2C-1.2 50.8,21.74 50.97,21.74 52.33,20.38 52.33,10.1 50.96,8.74 50.8,8.74 BH1750.2 | IC2.4 13.58,1.27 13.58,1.81 v13.94,2.17
N$3  (via drill 0.3 pad 0.61)  (3 unrouted)
  Top 0.254: 4.69,8.07 Y2.P$2 4.04,6.62 | IC31.7 4.69,8.15 4.69,8.07 | 4.69,8.07 | 4.04,6.62 2.9,6.62 C14.2 | 4.04,6.62 4.44,6.22 v4.57,6.09
  Bottom 0.254: R4.2 v4.57,6.09
N$19  (via drill 0.3 pad 0.61)  (3 unrouted)
  Top 0.254: 5.86,4.81 5.12,4.06 v4.34,4.06 | 5.86,4.81 5.46,5.21 6.01,5.75 6.01,8.33 IC31.8 | 5.86,4.81 Y2.P$1 7.51,3.16 7.63,3.16 C15.2
  Bottom 0.254: R4.1 4.57,3.84 v4.34,4.06
RAW  (via drill 0.3 pad 0.61)
  Top 0.254: v5.74,31.96 6.41,31.28 8.23,31.28 IC3.3
  Bottom 0.254: v5.74,31.96 3.88,31.96 3.53,31.61 3.53,28.07 4.05,27.55 L1.2
RESET  (via drill 0.3 pad 0.61)  (1 unrouted)
  Top 0.254: v5.33,16.14 5.08,16.14 5.04,16.1 IC31.29 | SV1.7 19.01,19.68 v17.9,20.8 | v19.22,26.31 19.02,26.5 19.02,26.67 R34.2
  Bottom 0.254: v19.22,26.31 18.23,26.31 17.86,25.95 17.86,21.96 18.08,21.74 18.08,20.98 v17.9,20.8 17.01,20.8 10.35,14.14 9.87,14.14 9.53,14.48 9.53,16.46 8.13,17.85 6.91,17.85 5.33,16.27 v5.33,16.14 | v5.33,16.14 | v5.33,16.14 4.38,16.14 1.78,13.54 RESET.2
RXD  (via drill 0.3 pad 0.61)  (1 unrouted)
  Top 0.254: v7.57,15.35 7.46,15.35 7.44,15.37 7.35,15.37 7.26,15.46 6.26,15.46 6.18,15.54 4.47,15.54 IC31.30
  Bottom 0.254: 19.68,21.18 21.41,21.18 22.45,22.23 SV1.6 | 19.68,21.18 | 19.68,21.18 17.36,18.86 16.23,18.86 10.68,13.32 9.54,13.32 8.71,14.15 8.71,16.11 8.32,16.51 7.83,16.51 7.49,16.16 7.49,15.43 v7.57,15.35
VCC  (via drill 0.3 pad 0.61)  (3 unrouted)
  Top 0.406: 6.23,10.82 IC31.6 4.83,9.41 4.74,9.49 v3.98,9.49 3.98,10.26 3.69,10.54 IC31.4 | 10.33,15.88 10.24,15.79 9.67,15.79 9.04,15.17 9.04,14.59 7.63,13.18 7.63,12.22 6.23,10.82 | 6.23,10.82 7.66,9.39 7.66,9.19 13.54,3.3 IC1.2 | 10.33,15.88 10.4,15.88 10.48,15.79 10.55,15.79 11.16,15.18 11.2,15.18 11.46,14.92 11.81,15.27 IC31.18 12.86,16.32 17.08,16.32 17.52,15.88 24.77,15.88 29.37,11.28 30.48,11.28 MOTION.1 | 4.27,27.96 4.27,24.74 4.13,24.6 C32.1 | OPT.1 4.27,30.91 4.27,27.96 | 4.27,27.96 6.87,27.96 IC3.2 12.36,27.96 | SV1.2 22.38,27.3 22.38,27.15 21.11,25.88 20.95,25.88 SV1.3 20.4,24.77 19.84,24.77 19.37,25.23 17.08,25.23 16.2,26.12 | v9.29,23.59 12.01,20.87 12.01,17.73 11.73,17.45 IC31.20 10.33,16.05 | 10.33,15.88 10.33,16.05 | 10.33,16.05 | 16.2,26.12 15.21,26.12 14.66,26.67 C31.1 12.36,27.96 | R34.1 16.2,26.12 | C5.2 13.45,29.84 13.45,29.05 12.36,27.96 | JP3.4 49.38,12.7 49.38,12.86 50.49,13.97 51.11,13.97 51.92,14.78 51.92,23.33 50.97,24.28 50.8,24.28 I2C-1.1 | JP3.1 BH1750.1
  Bottom 0.406: JP1.2 2.26,7.75 2.26,7.78 v3.98,9.49 | I2C-2.1 48.26,31.9 48.43,31.9 49.38,30.95 49.38,27.34 50.2,26.52 50.8,26.52 I2C-1.1 | 48.26,11.28 JP3.3 JP3.2 JP3.1 | JP3.4 48.26,11.28 | 48.26,11.28 32.55,11.28 31.6,10.33 31.6,10.16 MOTION.1 | 18.41,28.26 18.04,27.89 12.06,27.89 | 18.41,28.26 RS485.8 | 18.41,28.26 20.8,25.88 20.95,25.88 SV1.3 | 12.06,27.89 12.06,26.36 v9.29,23.59 3.17,17.46 3.01,17.46 R6.1 | C10.2 12.06,27.89
VCC1
  Bottom 0.406: 7.65,3.81 IC2.7 | 12.12,2.83 9.96,2.83 8.97,3.81 7.65,3.81 | 7.65,5.08 8.38,5.08 8.38,6.02 4.24,10.16 1.99,10.16 1.27,9.44 JP1.1 | IC2.8 7.65,5.08 | 7.65,5.08 7.65,3.81 | 12.12,2.83 12.15,2.86 14.08,2.86 R2.2 | 12.12,2.83 IC2.3
VIN
  Top 0.406: X2.1 12.62,33.47 13.63,33.47 16.25,30.85 16.25,28.35 16.82,27.78 19.37,27.78 19.84,27.3 SV1.1
  Bottom 0.406: F1.P$2 9.14,31.85 10.83,31.85 X2.1
VIN-FUSED  (via drill 0.3 pad 0.61)
  Top 0.406: v4.95,26.81 9.36,26.81 9.8,26.36 9.8,26.12 11.32,24.6 11.75,24.6 R1.1
  Bottom 0.406: F1.P$1 4.83,27.84 4.95,27.71 v4.95,26.81 v4.96,26.81 5.1,26.67 L1.1

### Text on the board
tNames: easyMySensors-RFM69, RFM95 / by Ranseyer Micro V0.2 | C31 | C32 | R34 | C5 | Config | C1 | R3 | R2 | R1 | Y2 | C15 | ATSHA
bNames: Ant | A1 | GND | GND | R4 | CE | Reset | D7
tDocu: 1 Vraw (typically unregulated voltage, either from motherboard to daughterboard or vice versa) Motherboard should have a jumper to cut onboard Vraw source if daughterboard provides Vraw. Be sure to check motherboard constraints on Vraw before connecting a daughterboard that provides Vraw (for over voltage protection). Should be able to source at least 100mA and all boards are recommended to support a voltage up to 24V on this pin. / 2 +3.3V fixed voltage (can source at least 100mA) / 3 VCCio (depending on MCU core voltage). Should not be used for heavy loads. / 4 GND / 5 MYSX_D1_DFM - Digital IO (USART TX (data from MCU)) / 6 MYSX_D2_DTM - Digital IO (USART RX (data to MCU)) / 7 MYSX_RST - Reset (On the board that carries the MCU, it is highly recommended that this pin has a 0.1uF capacitor in series for pulse “generation”) / 8 MYSX_LEGACY_ID – MYSX 1.x identification (2.0 daughterboards can tie this pin to VCC to allow the motherboard to determine if daughterboard is 1.x or 2.x. If identification is not needed or is undesired, pin can be used as regular analog input) / 9 MYSX_D3_INT - Digital IO (interrupt) / 10 MYSX_D4_INT - Digital IO (interrupt) / 11 MYSX_D5_PWM - Digital IO (PWM) / 12 MYSX_D6_PWM - Digital IO (PWM) / 13 MYSX_D7_SCL - Digital IO (I2C SCL) / 14 MYSX_D8_SDA - Digital IO (I2C SDA) / 15 MYSX_D9_A3 - Digital IO (analog input) / 16 MYSX_D10_A4 - Digital IO (analog input) / 17 MYSX_D11_MOSI - Digital IO (SPI MOSI) / 18 MYSX_D12_MISO - Digital IO (SPI MISO) / 19 MYSX_D13_SCK - Digital IO (SPI SCK) / 20 MYSX_D14_CS - Digital IO (also for SPI CS) / 21 MYSX_A5 - Analog input / 22 MYSX_A6 - Analog input